# Altium schematic sheet [06] - MEMORY.SchDoc: MEMORY
size A4; Organization: Bjørn T. Brodtkorb; Address1: Frode Rinnans veg 161; Address2: 7050 Trondheim; DocumentNumber: 6598; Revision: 1.0; SheetNumber: 1; SheetTotal: 1
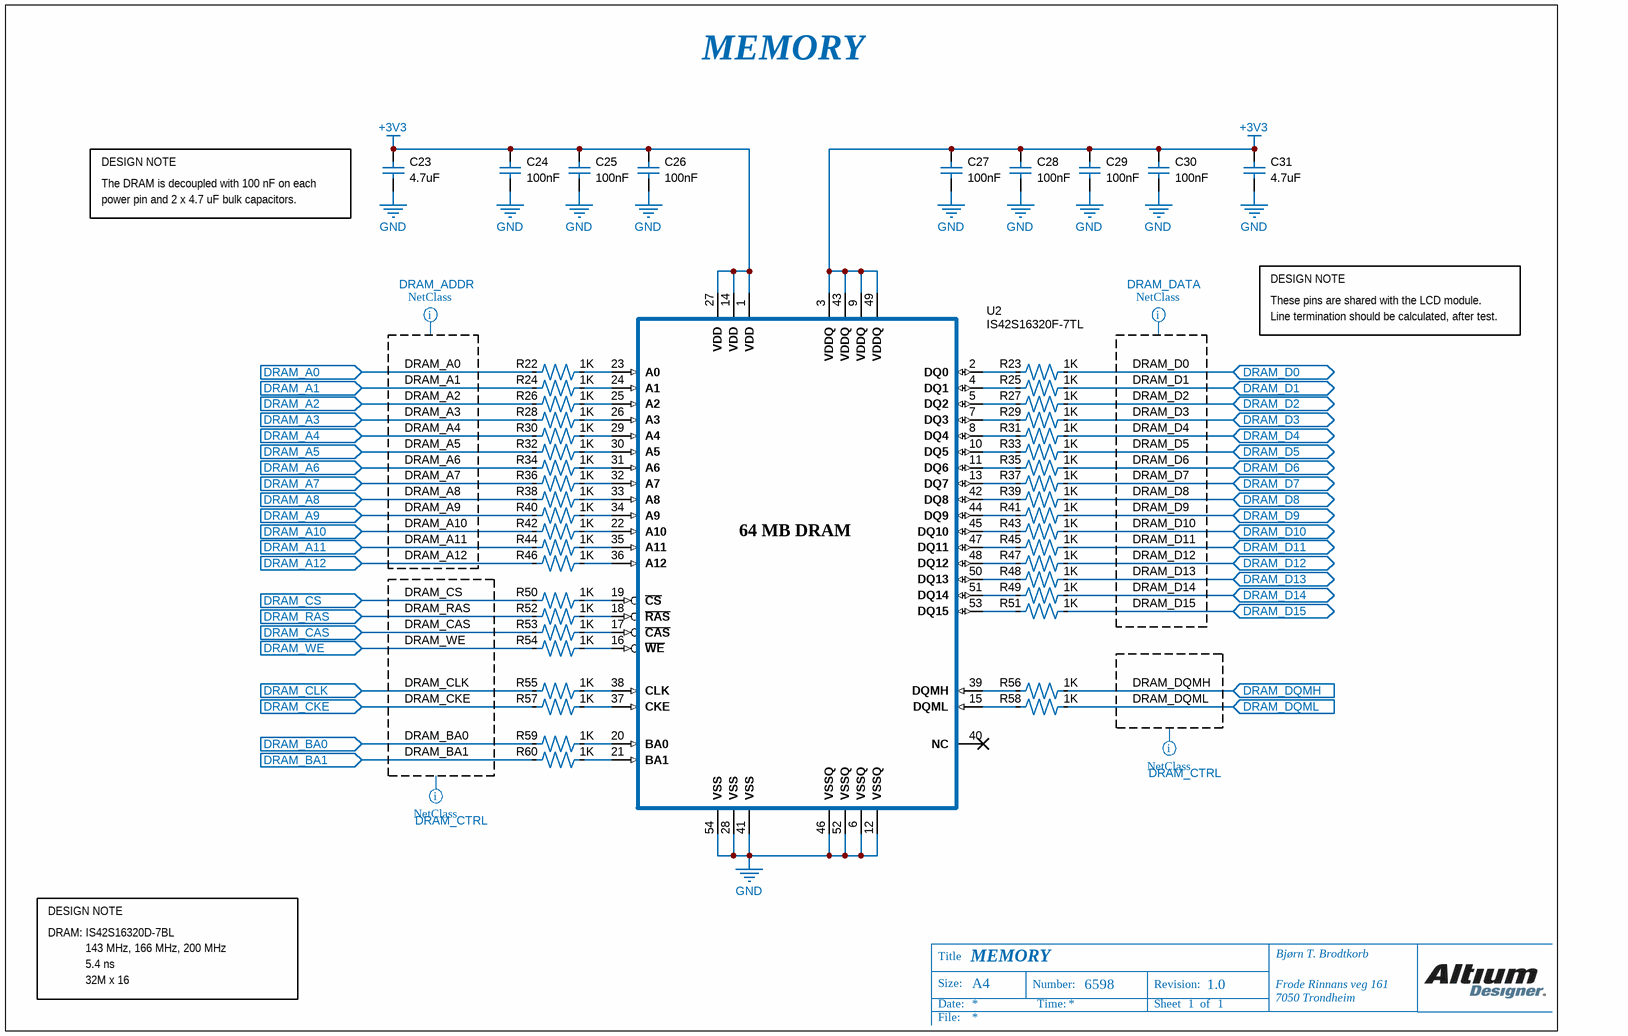
[diagram p0: [06] - MEMORY.SchDoc]

## Parts
C23  value 4.7uF  [C0603]  (hidden comment: 02016D104KAT2A)
C24  value 100nF  [C0402]  (hidden comment: 04023C103KAT2A)
C25  value 100nF  [C0402]  (hidden comment: 04023C103KAT2A)
C26  value 100nF  [C0402]  (hidden comment: 04023C103KAT2A)
C27  value 100nF  [C0402]  (hidden comment: 04023C103KAT2A)
C28  value 100nF  [C0402]  (hidden comment: 04023C103KAT2A)
C29  value 100nF  [C0402]  (hidden comment: 04023C103KAT2A)
C30  value 100nF  [C0402]  (hidden comment: 04023C103KAT2A)
C31  value 4.7uF  [C0603]  (hidden comment: 02016D104KAT2A)
R22  value 1K  [R0402]  (hidden comment: CRCW04020000Z0ED)
R23  value 1K  [R0402]  (hidden comment: CRCW04020000Z0ED)
R24  value 1K  [R0402]  (hidden comment: CRCW04020000Z0ED)
R25  value 1K  [R0402]  (hidden comment: CRCW04020000Z0ED)
R26  value 1K  [R0402]  (hidden comment: CRCW04020000Z0ED)
R27  value 1K  [R0402]  (hidden comment: CRCW04020000Z0ED)
R28  value 1K  [R0402]  (hidden comment: CRCW04020000Z0ED)
R29  value 1K  [R0402]  (hidden comment: CRCW04020000Z0ED)
R30  value 1K  [R0402]  (hidden comment: CRCW04020000Z0ED)
R31  value 1K  [R0402]  (hidden comment: CRCW04020000Z0ED)
R32  value 1K  [R0402]  (hidden comment: CRCW04020000Z0ED)
R33  value 1K  [R0402]  (hidden comment: CRCW04020000Z0ED)
R34  value 1K  [R0402]  (hidden comment: CRCW04020000Z0ED)
R35  value 1K  [R0402]  (hidden comment: CRCW04020000Z0ED)
R36  value 1K  [R0402]  (hidden comment: CRCW04020000Z0ED)
R37  value 1K  [R0402]  (hidden comment: CRCW04020000Z0ED)
R38  value 1K  [R0402]  (hidden comment: CRCW04020000Z0ED)
R39  value 1K  [R0402]  (hidden comment: CRCW04020000Z0ED)
R40  value 1K  [R0402]  (hidden comment: CRCW04020000Z0ED)
R41  value 1K  [R0402]  (hidden comment: CRCW04020000Z0ED)
R42  value 1K  [R0402]  (hidden comment: CRCW04020000Z0ED)
R43  value 1K  [R0402]  (hidden comment: CRCW04020000Z0ED)
R44  value 1K  [R0402]  (hidden comment: CRCW04020000Z0ED)
R45  value 1K  [R0402]  (hidden comment: CRCW04020000Z0ED)
R46  value 1K  [R0402]  (hidden comment: CRCW04020000Z0ED)
R47  value 1K  [R0402]  (hidden comment: CRCW04020000Z0ED)
R48  value 1K  [R0402]  (hidden comment: CRCW04020000Z0ED)
R49  value 1K  [R0402]  (hidden comment: CRCW04020000Z0ED)
R50  value 1K  [R0402]  (hidden comment: CRCW04020000Z0ED)
R51  value 1K  [R0402]  (hidden comment: CRCW04020000Z0ED)
R52  value 1K  [R0402]  (hidden comment: CRCW04020000Z0ED)
R53  value 1K  [R0402]  (hidden comment: CRCW04020000Z0ED)
R54  value 1K  [R0402]  (hidden comment: CRCW04020000Z0ED)
R55  value 1K  [R0402]  (hidden comment: CRCW04020000Z0ED)
R56  value 1K  [R0402]  (hidden comment: CRCW04020000Z0ED)
R57  value 1K  [R0402]  (hidden comment: CRCW04020000Z0ED)
R58  value 1K  [R0402]  (hidden comment: CRCW04020000Z0ED)
R59  value 1K  [R0402]  (hidden comment: CRCW04020000Z0ED)
R60  value 1K  [R0402]  (hidden comment: CRCW04020000Z0ED)
U2  IS42S16320F-7TL  [IS42S16320F-7TL]

## Ports
DRAM_A0 (in), DRAM_A1 (in), DRAM_A2 (in), DRAM_A3 (in), DRAM_A4 (in), DRAM_A5 (in), DRAM_A6 (in), DRAM_A7 (in), DRAM_A8 (in), DRAM_A9 (in), DRAM_A10 (in), DRAM_A11 (in), DRAM_A12 (in), DRAM_BA0 (in), DRAM_BA1 (in), DRAM_CAS (in), DRAM_CKE (in), DRAM_CLK (in), DRAM_CS (in), DRAM_D0 (bidir), DRAM_D1 (bidir), DRAM_D2 (bidir), DRAM_D3 (bidir), DRAM_D4 (bidir), DRAM_D5 (bidir), DRAM_D6 (bidir), DRAM_D7 (bidir), DRAM_D8 (bidir), DRAM_D9 (bidir), DRAM_D10 (bidir), DRAM_D11 (bidir), DRAM_D12 (bidir), DRAM_D13 (bidir), DRAM_D14 (bidir), DRAM_D15 (bidir), DRAM_DQMH (in), DRAM_DQML (in), DRAM_RAS (in), DRAM_WE (in)

## Nets
+3V3: C23.2 C24.2 C25.2 C26.2 C27.2 C28.2 C29.2 C30.2 C31.2 U2.1(VDD) U2.3(VDDQ) U2.9(VDDQ) U2.14(VDD) U2.27(VDD) U2.43(VDDQ) U2.49(VDDQ)
GND: C23.1 C24.1 C25.1 C26.1 C27.1 C28.1 C29.1 C30.1 C31.1 U2.6(VSSQ) U2.12(VSSQ) U2.28(VSS) U2.41(VSS) U2.46(VSSQ) U2.52(VSSQ) U2.54(VSS)
DRAM_A0: R22.1 ; port DRAM_A0
DRAM_A1: R24.1 ; port DRAM_A1
DRAM_A2: R26.1 ; port DRAM_A2
DRAM_A3: R28.1 ; port DRAM_A3
DRAM_A4: R30.1 ; port DRAM_A4
DRAM_A5: R32.1 ; port DRAM_A5
DRAM_A6: R34.1 ; port DRAM_A6
DRAM_A7: R36.1 ; port DRAM_A7
DRAM_A8: R38.1 ; port DRAM_A8
DRAM_A9: R40.1 ; port DRAM_A9
DRAM_A10: R42.1 ; port DRAM_A10
DRAM_A11: R44.1 ; port DRAM_A11
DRAM_A12: R46.1 ; port DRAM_A12
DRAM_BA0: R59.1 ; port DRAM_BA0
DRAM_BA1: R60.1 ; port DRAM_BA1
DRAM_CAS: R53.1 ; port DRAM_CAS
DRAM_CKE: R57.1 ; port DRAM_CKE
DRAM_CLK: R55.1 ; port DRAM_CLK
DRAM_CS: R50.1 ; port DRAM_CS
DRAM_D0: R23.2 ; port DRAM_D0
DRAM_D1: R25.2 ; port DRAM_D1
DRAM_D2: R27.2 ; port DRAM_D2
DRAM_D3: R29.2 ; port DRAM_D3
DRAM_D4: R31.2 ; port DRAM_D4
DRAM_D5: R33.2 ; port DRAM_D5
DRAM_D6: R35.2 ; port DRAM_D6
DRAM_D7: R37.2 ; port DRAM_D7
DRAM_D8: R39.2 ; port DRAM_D8
DRAM_D9: R41.2 ; port DRAM_D9
DRAM_D10: R43.2 ; port DRAM_D10
DRAM_D11: R45.2 ; port DRAM_D11
DRAM_D12: R47.2 ; port DRAM_D12
DRAM_D13: R48.2 ; port DRAM_D13
DRAM_D14: R49.2 ; port DRAM_D14
DRAM_D15: R51.2 ; port DRAM_D15
DRAM_DQMH: R56.2 ; port DRAM_DQMH
DRAM_DQML: R58.2 ; port DRAM_DQML
DRAM_RAS: R52.1 ; port DRAM_RAS
DRAM_WE: R54.1 ; port DRAM_WE
NetR22_2: R22.2 U2.23(A0)
NetR23_1: R23.1 U2.2(DQ0)
NetR24_2: R24.2 U2.24(A1)
NetR25_1: R25.1 U2.4(DQ1)
NetR26_2: R26.2 U2.25(A2)
NetR27_1: R27.1 U2.5(DQ2)
NetR28_2: R28.2 U2.26(A3)
NetR29_1: R29.1 U2.7(DQ3)
NetR30_2: R30.2 U2.29(A4)
NetR31_1: R31.1 U2.8(DQ4)
NetR32_2: R32.2 U2.30(A5)
NetR33_1: R33.1 U2.10(DQ5)
NetR34_2: R34.2 U2.31(A6)
NetR35_1: R35.1 U2.11(DQ6)
NetR36_2: R36.2 U2.32(A7)
NetR37_1: R37.1 U2.13(DQ7)
NetR38_2: R38.2 U2.33(A8)
NetR39_1: R39.1 U2.42(DQ8)
NetR40_2: R40.2 U2.34(A9)
NetR41_1: R41.1 U2.44(DQ9)
NetR42_2: R42.2 U2.22(A10)
NetR43_1: R43.1 U2.45(DQ10)
NetR44_2: R44.2 U2.35(A11)
NetR45_1: R45.1 U2.47(DQ11)
NetR46_2: R46.2 U2.36(A12)
NetR47_1: R47.1 U2.48(DQ12)
NetR48_1: R48.1 U2.50(DQ13)
NetR49_1: R49.1 U2.51(DQ14)
NetR50_2: R50.2 U2.19(~{CS})
NetR51_1: R51.1 U2.53(DQ15)
NetR52_2: R52.2 U2.18(~{RAS})
NetR53_2: R53.2 U2.17(~{CAS})
NetR54_2: R54.2 U2.16(~{WE})
NetR55_2: R55.2 U2.38(CLK)
NetR56_1: R56.1 U2.39(DQMH)
NetR57_2: R57.2 U2.37(CKE)
NetR58_1: R58.1 U2.15(DQML)
NetR59_2: R59.2 U2.20(BA0)
NetR60_2: R60.2 U2.21(BA1)

Not connected (* = marked no-connect by the designer): U2 40(NC)*

## Layout directives
net class DRAM_DATA: DRAM_D0, DRAM_D1, DRAM_D2, DRAM_D3, DRAM_D4, DRAM_D5, DRAM_D6, DRAM_D7, DRAM_D8, DRAM_D9, DRAM_D10, DRAM_D11, DRAM_D12, DRAM_D13, DRAM_D14, DRAM_D15
net class DRAM_ADDR: DRAM_A0, DRAM_A1, DRAM_A2, DRAM_A3, DRAM_A4, DRAM_A5, DRAM_A6, DRAM_A7, DRAM_A8, DRAM_A9, DRAM_A10, DRAM_A11, DRAM_A12
net class DRAM_CTRL: DRAM_BA0, DRAM_BA1, DRAM_CAS, DRAM_CKE, DRAM_CLK, DRAM_CS, DRAM_DQMH, DRAM_DQML, DRAM_RAS, DRAM_WE

## Notes on the sheet
- MEMORY
- DESIGN NOTE
- (near C23) The DRAM is decoupled with 100 nF on each
- (near C23) power pin and 2 x 4.7 uF bulk capacitors.
- These pins are shared with the LCD module.
- Line termination should be calculated, after test.
- DRAM: IS42S16320D-7BL
- 143 MHz, 166 MHz, 200 MHz
- 5.4 ns
- 32M x 16
- Title
- Size:
- A4
- Number:
- Revision:
- Date:
- File:
- Time:
- Sheet
- of
- (in symbol IS42S16320F-7TL) 64 MB DRAM

## Library data of the parts
C23 C31 = 02016D104KAT2A: C0603
C24-C30 = 04023C103KAT2A: C0402
R22-R60 = CRCW04020000Z0ED: R0402
U2 = IS42S16320F-7TL: SDRAM 512Mb 32Mx16 TSOP; Clock cycle time: 7.5 ns; Clock frequency: 143 MHz; Supplier 1: Digi-Key; Supplier Part Number 1: 706-1450-5-ND